# Altium schematic sheet GPIO.SchDoc: APTOMAT - Power Supply
size A3; Revision: 1.1.1; SheetNumber: 5; SheetTotal: 5; DrawnBy: KJP; ProjectNumber: 4397; PCBRevision: 0071KJP; DocumentSize: A4; PCAName: PCA10040; PCBNumber: 400150; ProjectName: Quark
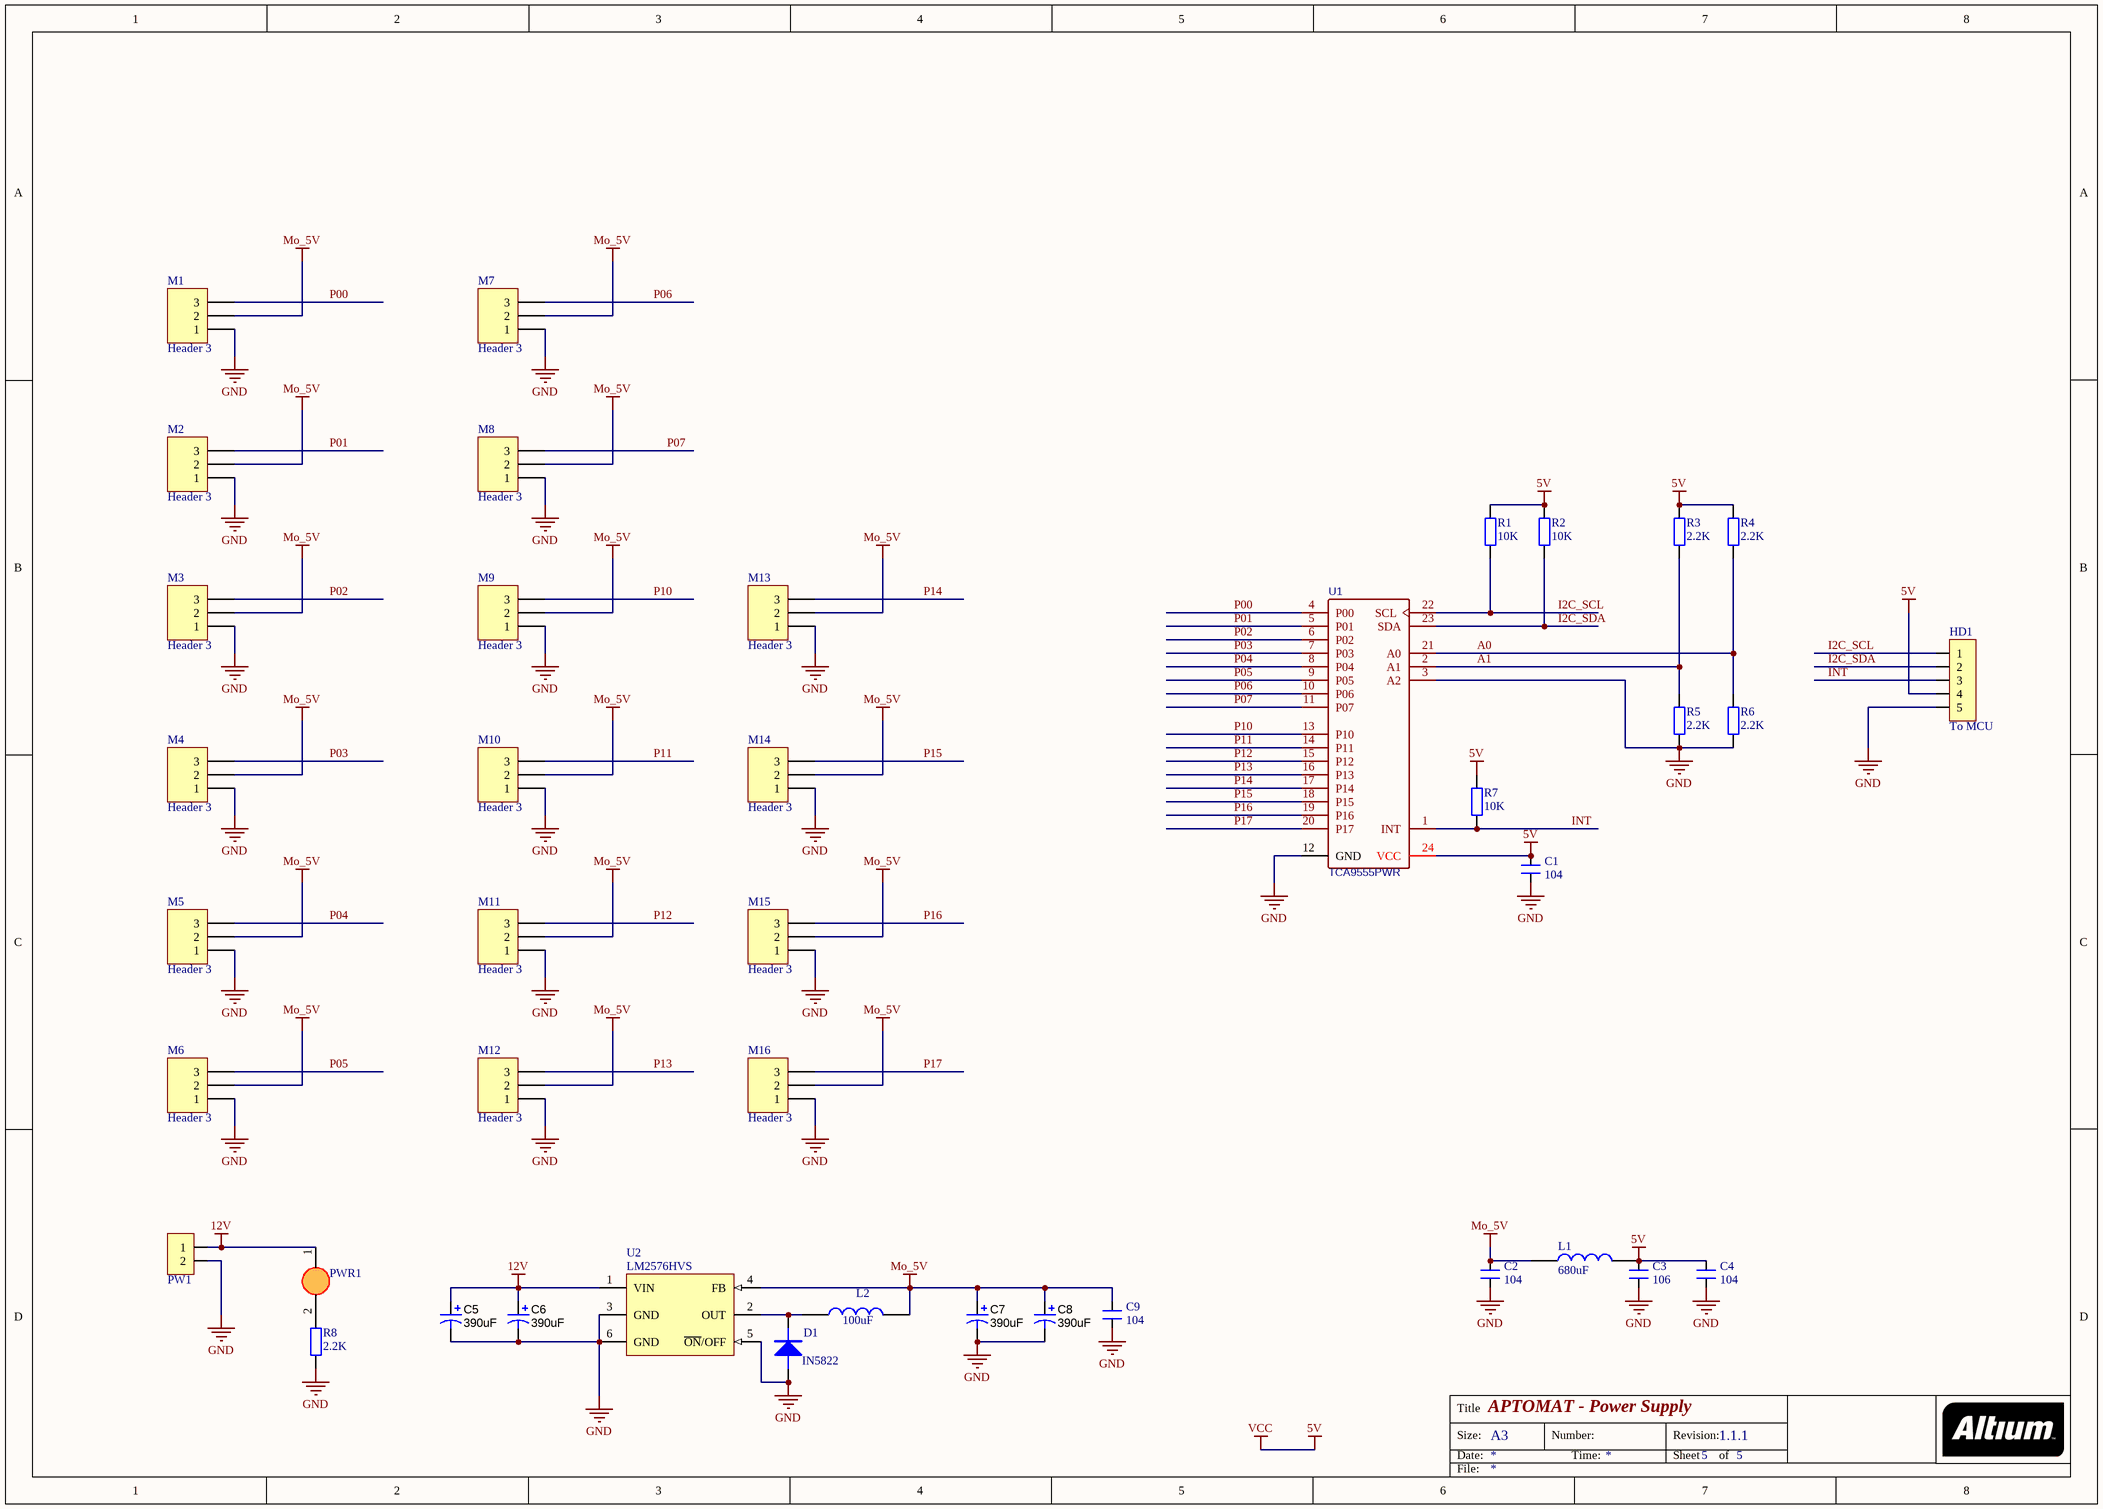
[diagram p0: GPIO.SchDoc]

## Parts
C1  104  [0805_HV]
C2  104  [0805_HV]
C3  106  [0805_HV]
C4  104  [0805_HV]
C5  390uF  [CP1/3.0]
C6  390uF  [CP1/3.0]
C7  390uF  [CP1/3.0]
C8  390uF  [CP1/3.0]
C9  104  [0805_HV]
D1  IN5822  [SOD123]
HD1  To MCU  [HEADER 5]
L1  680uF  [Inductor 4.5x5]
L2  100uF  [IND_2118-V-RC]
M1  Header 3  [HDR1X3]
M2  Header 3  [HDR1X3]
M3  Header 3  [HDR1X3]
M4  Header 3  [HDR1X3]
M5  Header 3  [HDR1X3]
M6  Header 3  [HDR1X3]
M7  Header 3  [HDR1X3]
M8  Header 3  [HDR1X3]
M9  Header 3  [HDR1X3]
M10  Header 3  [HDR1X3]
M11  Header 3  [HDR1X3]
M12  Header 3  [HDR1X3]
M13  Header 3  [HDR1X3]
M14  Header 3  [HDR1X3]
M15  Header 3  [HDR1X3]
M16  Header 3  [HDR1X3]
PW1  CON 2 EDG 5.08_MH  [CON 2 EDG 5.08]  (value not drawn)
PWR1  LED3  [LED_0805]  (value not drawn)
R1  10K  [0805_HV]
R2  10K  [0805_HV]
R3  2.2K  [0805_HV]
R4  2.2K  [0805_HV]
R5  2.2K  [0805_HV]
R6  2.2K  [0805_HV]
R7  10K  [0805_HV]
R8  2.2K  [Tro SMD 0805]
U1  TCA9555PWR  [TSSOP-24]
U2  LM2576HVS  [TO263-5]

## Nets
5V: C1.2 C3.2 C4.2 HD1.4 L1.2 R1.2 R2.2 R3.2 R4.2 R7.2 U1.24(VCC)  [also labelled VCC]
12V: C5.1(+) C6.1(+) PW1.1 PWR1.1(A) U2.1(VIN)
GND: C1.1 C2.1 C3.1 C4.1 C5.2(-) C6.2(-) C7.2(-) C8.2(-) C9.1 D1.1 HD1.5 M1.1 M2.1 M3.1 M4.1 M5.1 M6.1 M7.1 M8.1 M9.1 M10.1 M11.1 M12.1 M13.1 M14.1 M15.1 M16.1 PW1.2 R5.1 R6.1 R8.1 U1.3(A2) U1.12(GND) U2.3(GND) U2.5(~{ON}/OFF) U2.6(GND)
Mo_5V: C2.2 C7.1(+) C8.1(+) C9.2 L1.1 L2.2 M1.2 M2.2 M3.2 M4.2 M5.2 M6.2 M7.2 M8.2 M9.2 M10.2 M11.2 M12.2 M13.2 M14.2 M15.2 M16.2 U2.4(FB)
A0: R4.1 R6.2 U1.21(A0)
A1: R3.1 R5.2 U1.2(A1)
I2C_SCL: HD1.1 R1.1 U1.22(SCL)
I2C_SDA: HD1.2 R2.1 U1.23(SDA)
INT: HD1.3 R7.1 U1.1(INT)
P00: M1.3 U1.4(P00)
P01: M2.3 U1.5(P01)
P02: M3.3 U1.6(P02)
P03: M4.3 U1.7(P03)
P04: M5.3 U1.8(P04)
P05: M6.3 U1.9(P05)
P06: M7.3 U1.10(P06)
P07: M8.3 U1.11(P07)
P10: M9.3 U1.13(P10)
P11: M10.3 U1.14(P11)
P12: M11.3 U1.15(P12)
P13: M12.3 U1.16(P13)
P14: M13.3 U1.17(P14)
P15: M14.3 U1.18(P15)
P16: M15.3 U1.19(P16)
P17: M16.3 U1.20(P17)
NetD1_2: D1.2 L2.1 U2.2(OUT)
NetPWR1_2: PWR1.2(K) R8.2

## Notes on the sheet
- Title
- Size:
- Date:
- A3
- Number:
- Time:
- Revision:
- Sheet
- of
- File:

## Library data of the parts
C1-C4 C9 = CM: Cap SMD; Value: 103
C5-C8 = Capacitor TuHoa: PartNumber: UHW1H391MPD6; Manufacturer: Nichicon; Polarized: Y; U/M: EA; Cap_F: 0.000390; Tolerance_%: 20; Value1: Unknown; VDC_V: 50; Value2: 50V; TaMin_C: -40; TaMax_C: 105; Cap_Case: 10x22; AEC Category: Q200; AEC Qualified: N; CompType: Capacitor; SymbolVersion: 2008-07-09; Value: 390uF; PackageReference: 10x22; RoHS: Y; MountType: TH; Technology: AL; Series: ZL; Publisher: Texas Instruments; LatestRevisionDate: 2015-12-17; ComponentLink1Description: Datasheet link; ComponentLink1URL: http://nichicon-us.com/english/products/pdfs/e-uhw.pdf; Supplier 1: Digi-Key; Supplier Part Number 1: 493-6885-ND; AEC Grade: N/A; ValueDisplayed: 390uF
D1 = Diode S4 SOD123 ( 1N5819 SOD123)_MH: Diode S4 SOD123 ( 1N5819 SOD123)
HD1 = Header 5_MH: Header 5P XH2.54 thẳng
L1 = Inductor 4.5x5_MH
L2 = Inductor Lm2576_MH: cuon cam
M1-M16 = Header 3: Header, 3-Pin; LatestRevisionDate: 17-Jul-2002; LatestRevisionNote: Re-released for DXP Platform.; Publisher: Altium Limited
PW1 = CON 2 EDG 5.08_MH: CON 2 EDG 5.08 (xanh cong)
PWR1 = LED SMD_0805_MH: LED 3mm
R1-R8 = TRO_SMD_0805_MH
U2 = LM2576HVS-5.0V BUCK 5V 3A TO263-5 _MH: PartNumber: LM2576T-5.0; Manufacturer: National Semiconductor; CompType: Switcher; PackageTopMarking: NSUZXYTT*LM2576T*-5.0 P+; PowerWise: N; FirstPublished: 4-Dec-2008; DatasheetVersion: Aug-2004; PackageVersion: revJ, Jan-1992; PackageReference: T05A; Publisher: Altium Limited; PackageDescription: TO-220, Molded, 5 Lead, Straight; RoHS: O; PinCount: 5; DigiKeyPartNumber: LM2576T-5.0-ND; Code_JEDEC: TO-220-AB; ComponentLink1Description: LM2576 Datasheet; ComponentLink1URL: http://www.national.com/ds/LM/LM2576.pdf; ComponentLink2Description: LM2576 Web Page; ComponentLink2URL: http://www.national.com/pf/LM/LM2576.html; ComponentLink3Description: T05A Package Page; ComponentLink3URL: http://www.national.com/packaging/folders/t05a.html
U1 = TCA9555PWR: BOM_Manufacturer Part: ?; spicePre: U